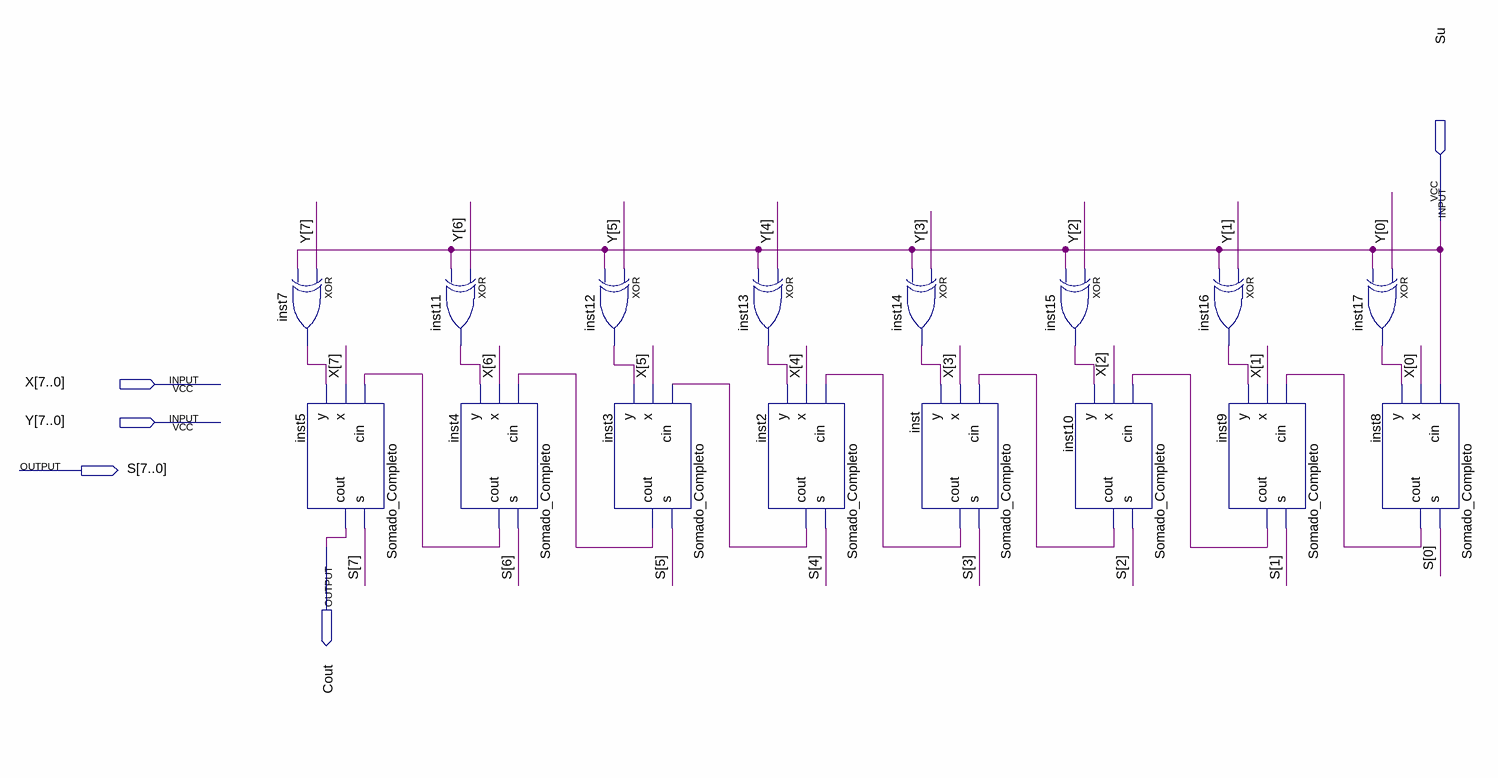
[diagram p0: schematic sheet]
// Quartus schematic Somador_8b.bdf as structural Verilog: 16 symbols, 5 pins
module Somador_8b (
  input  Su,
  input  [7:0] X,
  input  [7:0] Y,
  output [7:0] S,
  output Cout
);

  wire inst2_cout, inst3_cout, inst4_cout, inst7_out, inst8_cout, inst9_cout, inst10_cout, inst11_out,
       inst12_out, inst13_out, inst14_out, inst15_out, inst16_out, inst17_out, inst_cout;

  xor inst7 (inst7_out, Y[7], Su);
  Somado_Completo inst5 (.cin(inst4_cout), .x(X[7]), .y(inst7_out), .s(S[7]), .cout(Cout));
  xor inst11 (inst11_out, Y[6], Su);
  Somado_Completo inst4 (.cin(inst3_cout), .x(X[6]), .y(inst11_out), .s(S[6]), .cout(inst4_cout));
  xor inst12 (inst12_out, Y[5], Su);
  Somado_Completo inst3 (.cin(inst2_cout), .x(X[5]), .y(inst12_out), .s(S[5]), .cout(inst3_cout));
  xor inst13 (inst13_out, Y[4], Su);
  Somado_Completo inst2 (.cin(inst_cout), .x(X[4]), .y(inst13_out), .s(S[4]), .cout(inst2_cout));
  xor inst14 (inst14_out, Y[3], Su);
  Somado_Completo inst (.cin(inst10_cout), .x(X[3]), .y(inst14_out), .s(S[3]), .cout(inst_cout));
  xor inst15 (inst15_out, Y[2], Su);
  Somado_Completo inst10 (.cin(inst9_cout), .x(X[2]), .y(inst15_out), .s(S[2]), .cout(inst10_cout));
  xor inst16 (inst16_out, Y[1], Su);
  Somado_Completo inst9 (.cin(inst8_cout), .x(X[1]), .y(inst16_out), .s(S[1]), .cout(inst9_cout));
  xor inst17 (inst17_out, Y[0], Su);
  Somado_Completo inst8 (.cin(Su), .x(X[0]), .y(inst17_out), .s(S[0]), .cout(inst8_cout));
endmodule
